# EAGLE design testBench (EAGLE 9.6.2)
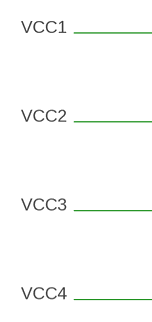
[diagram p0: schematic, sheet 1, part 1 of 2]
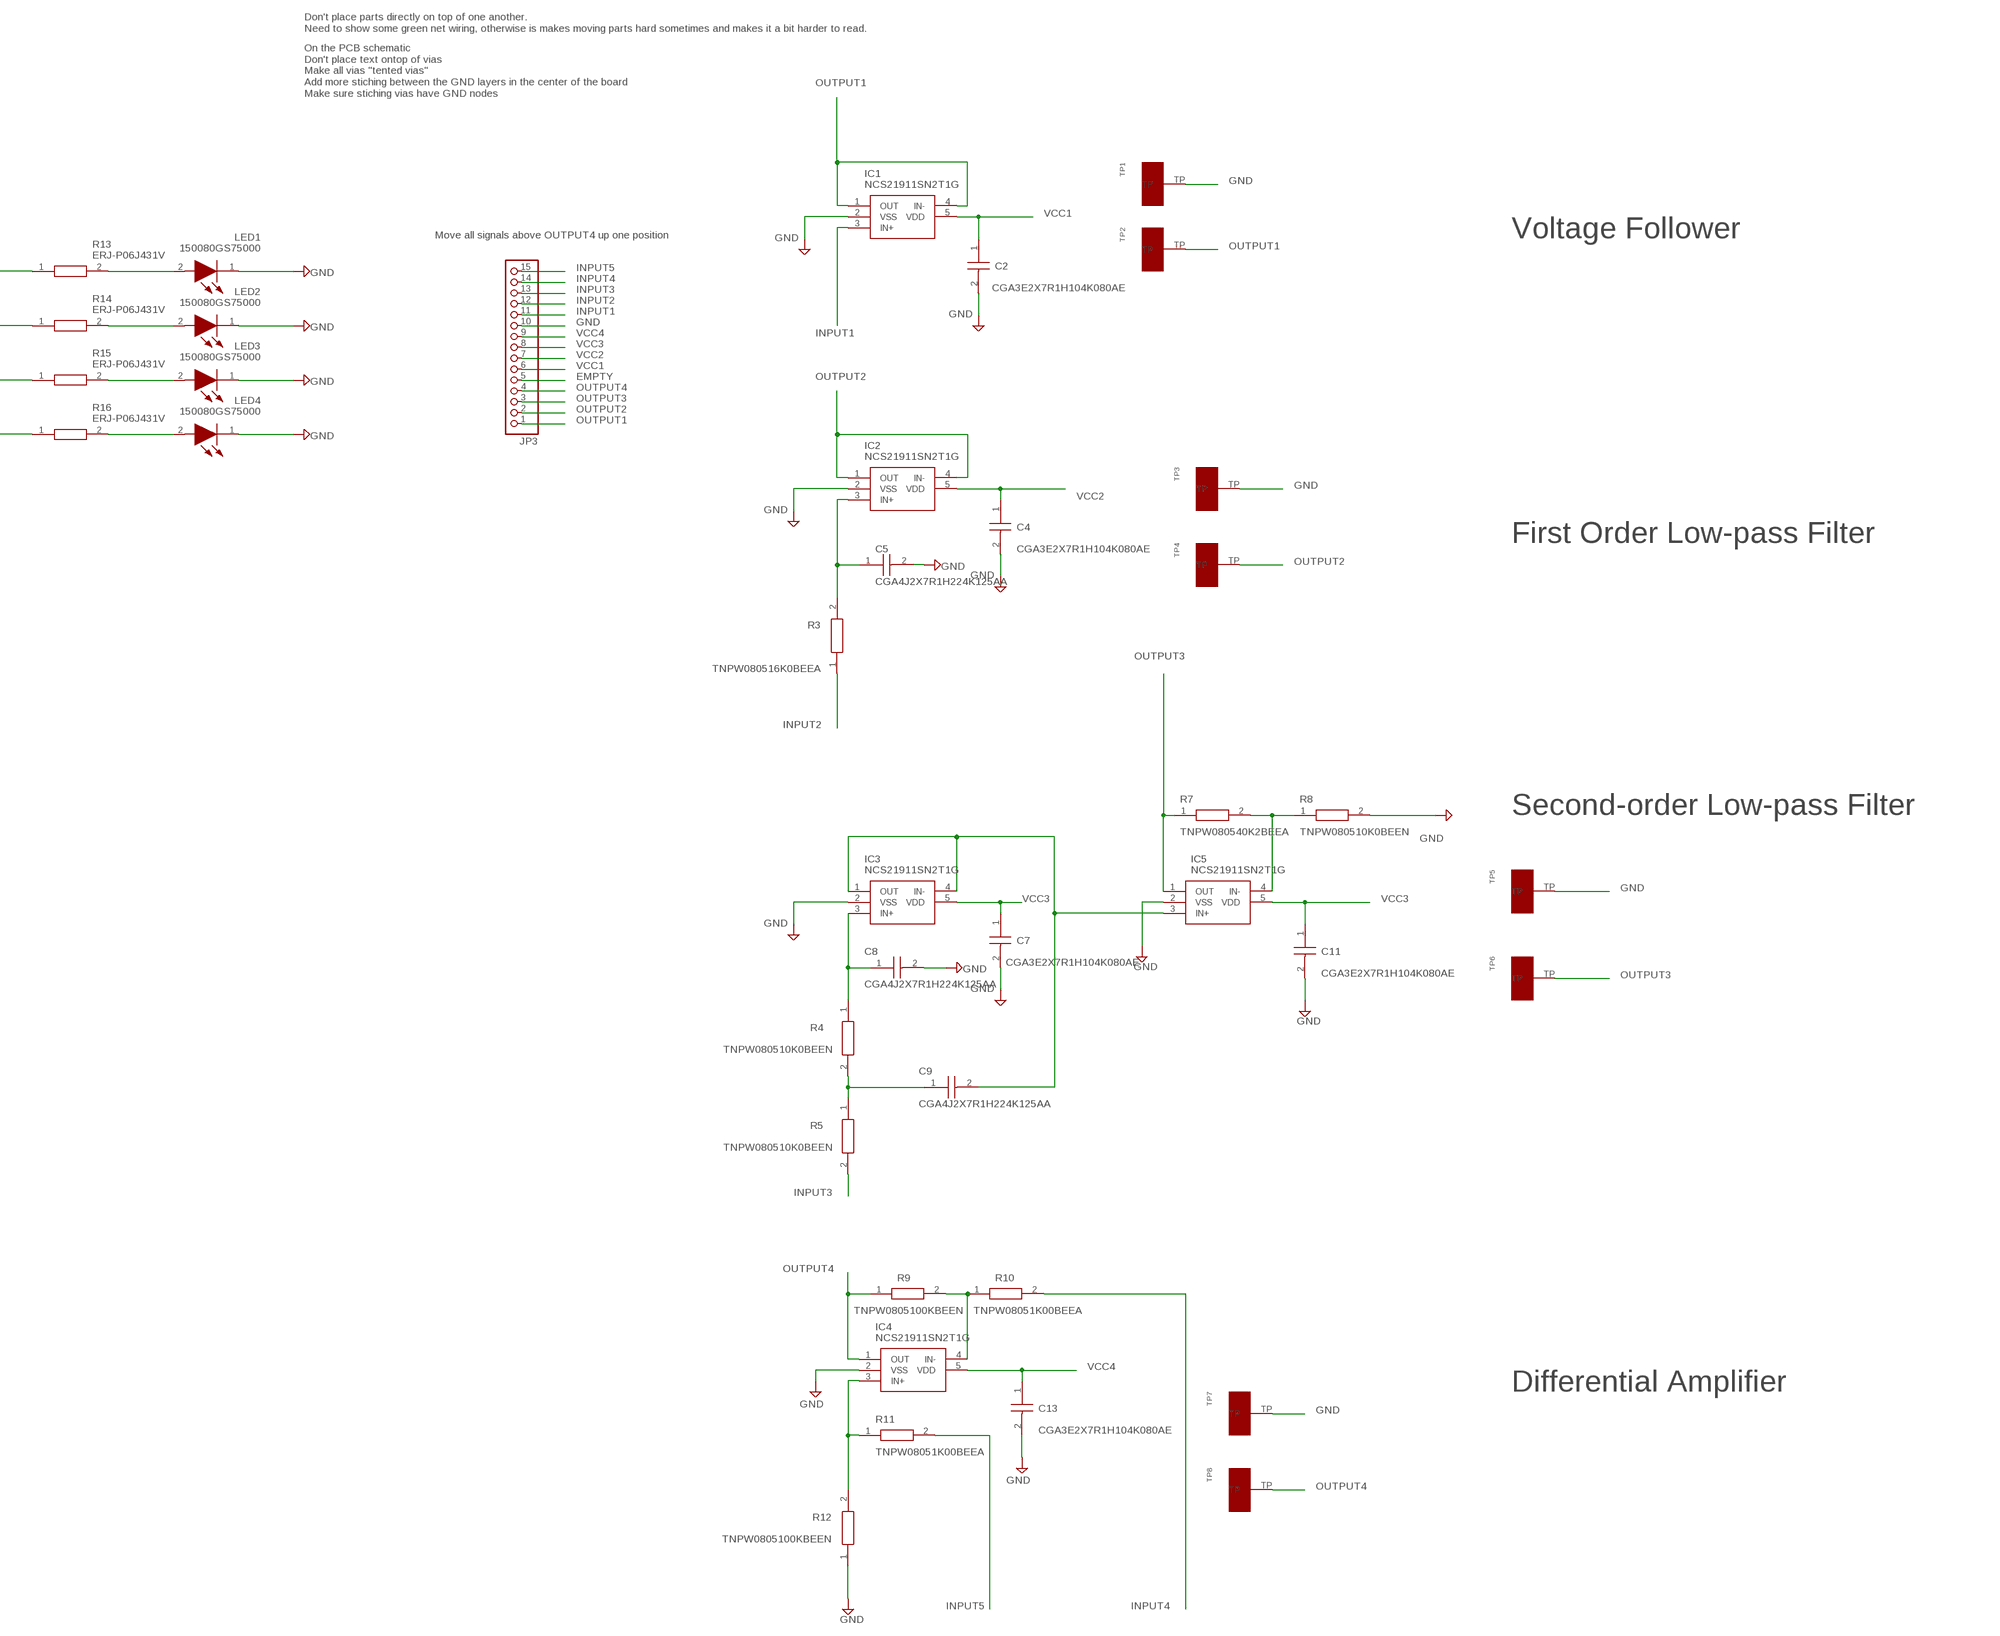
[diagram p1: schematic, sheet 1, part 2 of 2]

## Parts
C2  CGA3E2X7R1H104K080AE  [CAPC1608X90N]
C4  CGA3E2X7R1H104K080AE  [CAPC1608X90N]
C5  CGA4J2X7R1H224K125AA  [CAPC2012X145N]
C7  CGA3E2X7R1H104K080AE  [CAPC1608X90N]
C8  CGA4J2X7R1H224K125AA  [CAPC2012X145N]
C9  CGA4J2X7R1H224K125AA  [CAPC2012X145N]
C11  CGA3E2X7R1H104K080AE  [CAPC1608X90N]
C13  CGA3E2X7R1H104K080AE  [CAPC1608X90N]
IC1  NCS21911SN2T1G  [SOT95P275X110-5N]
IC2  NCS21911SN2T1G  [SOT95P275X110-5N]
IC3  NCS21911SN2T1G  [SOT95P275X110-5N]
IC4  NCS21911SN2T1G  [SOT95P275X110-5N]
IC5  NCS21911SN2T1G  [SOT95P275X110-5N]
JP3  PINHD-1X15  [1X15]
LED1  150080GS75000  [LEDM2012X80N]
LED2  150080GS75000  [LEDM2012X80N]
LED3  150080GS75000  [LEDM2012X80N]
LED4  150080GS75000  [LEDM2012X80N]
R3  TNPW080516K0BEEA  TNPW080510K0BEEN  [RESC2013X65N]
R4  TNPW080510K0BEEN  [RESC2013X65N]
R5  TNPW080510K0BEEN  [RESC2013X65N]
R7  TNPW080540K2BEEA  [RESC2013X65N]
R8  TNPW080510K0BEEN  [RESC2013X65N]
R9  TNPW0805100KBEEN  [RESC2013X65N]
R10  TNPW08051K00BEEA  [RESC2012X55N]
R11  TNPW08051K00BEEA  [RESC2012X55N]
R12  TNPW0805100KBEEN  [RESC2013X65N]
R13  ERJ-P06J431V  [ERJP06_(0805)]
R14  ERJ-P06J431V  [ERJP06_(0805)]
R15  ERJ-P06J431V  [ERJP06_(0805)]
R16  ERJ-P06J431V  [ERJP06_(0805)]
TP1  S1751-46R  [1.85X3.45_MM]
TP2  S1751-46R  [1.85X3.45_MM]
TP3  S1751-46R  [1.85X3.45_MM]
TP4  S1751-46R  [1.85X3.45_MM]
TP5  S1751-46R  [1.85X3.45_MM]
TP6  S1751-46R  [1.85X3.45_MM]
TP7  S1751-46R  [1.85X3.45_MM]
TP8  S1751-46R  [1.85X3.45_MM]

## Nets
EMPTY: JP3.5
GND: C2.2 C4.2 C5.2 C7.2 C8.2 C11.2 C13.2 IC1.2(VSS) IC2.2(VSS) IC3.2(VSS) IC4.2(VSS) IC5.2(VSS) JP3.10 LED1.1(K) LED2.1(K) LED3.1(K) LED4.1(K) R8.2 R12.1 TP1.TP TP3.TP TP5.TP TP7.TP
INPUT1: IC1.3(IN+) JP3.11
INPUT2: JP3.12 R3.1
INPUT3: JP3.13 R5.2
INPUT4: JP3.14 R10.2
INPUT5: JP3.15 R11.2
N$1: C8.1 IC3.3(IN+) R4.1
N$10: C9.1 R4.2 R5.1
N$11: C9.2 IC3.1(OUT) IC3.4(IN-) IC5.3(IN+)
N$12: IC4.3(IN+) R11.1 R12.2
N$13: C5.1 IC2.3(IN+) R3.2
N$15: IC4.4(IN-) R9.2 R10.1
N$20: IC5.4(IN-) R7.2 R8.1
N$23: LED1.2(A) R13.2
N$30: LED2.2(A) R14.2
N$31: LED3.2(A) R15.2
N$32: LED4.2(A) R16.2
OUTPUT1: IC1.1(OUT) IC1.4(IN-) JP3.1 TP2.TP
OUTPUT2: IC2.1(OUT) IC2.4(IN-) JP3.2 TP4.TP
OUTPUT3: IC5.1(OUT) JP3.3 R7.1 TP6.TP
OUTPUT4: IC4.1(OUT) JP3.4 R9.1 TP8.TP
VCC1: C2.1 IC1.5(VDD) JP3.6 R13.1
VCC2: C4.1 IC2.5(VDD) JP3.7 R14.1
VCC3: C7.1 C11.1 IC3.5(VDD) IC5.5(VDD) JP3.8 R15.1
VCC4: C13.1 IC4.5(VDD) JP3.9 R16.1

## Notes on the sheet
- Don't place parts directly on top of one another.
  Need to show some green net wiring, otherwise is makes moving parts hard sometimes and makes it a bit harder to read.
- On the PCB schematic
  Don't place text ontop of vias
  Make all vias "tented vias"
  Add more stiching between the GND layers in the center of the board
  Make sure stiching vias have GND nodes
- Move all signals above OUTPUT4 up one position | Voltage Follower
- First Order Low-pass Filter
- Second-order Low-pass Filter
- Differential Amplifier

## Library data of the parts
C2 C4 C7 C11 C13 = SamacSys_Parts:CGA3E2X7R1H104K080AE: Source: Datasheet; HEIGHT: 0.9mm; MANUFACTURER_NAME: TDK; MANUFACTURER_PART_NUMBER: CGA3E2X7R1H104K080AE; MOUSER_PART_NUMBER: 810-CGA3E2X7R1H104KE; MOUSER_PRICE-STOCK: https://www.mouser.co.uk/ProductDetail/TDK/CGA3E2X7R1H104K080AE?qs=n%2FVzw7c4a0kvajqFvEbDzQ%3D%3D
C5 C8 C9 = SamacSys_Parts:CGA4J2X7R1H224K125AA: Capacitor Auto CGA 0805 50V 220nF X7R Source: Datasheet; DESCRIPTION: Capacitor Auto CGA 0805 50V 220nF X7R; HEIGHT: 1.45mm; MANUFACTURER_NAME: TDK; MANUFACTURER_PART_NUMBER: CGA4J2X7R1H224K125AA; MOUSER_PART_NUMBER: 810-CGA4J2X7R1H224K; MOUSER_PRICE-STOCK: https://www.mouser.co.uk/ProductDetail/TDK/CGA4J2X7R1H224K125AA?qs=NRhsANhppD9di1dONpUYtQ%3D%3D
IC1-IC5 = SamacSys_Parts:NCS21911SN2T1G: Operational Amplifiers - Op Amps 2 MHz Source: Datasheet <https://www.arrow.com/en/products/ncs21911sn2t1g/on-semiconductor>; DESCRIPTION: Operational Amplifiers - Op Amps 2 MHz; HEIGHT: 1.1mm; MANUFACTURER_NAME: ON Semiconductor; MANUFACTURER_PART_NUMBER: NCS21911SN2T1G; MOUSER_PART_NUMBER: 863-NCS21911SN2T1G; MOUSER_PRICE-STOCK: https://www.mouser.co.uk/ProductDetail/ON-Semiconductor/NCS21911SN2T1G/?qs=%252B6g0mu59x7Ix%2FTFBhvJ5Cw%3D%3D
JP3 = pinhead:PINHD-1X15: PIN HEADER
LED1-LED4 = SamacSys_Parts:150080GS75000: 150080GS75000, Wurth Elektronik WL-SMCW 520 nm Green LED, 2012 (0805) Clear SMD package Source: Datasheet <https://katalog.we-online.com/led/datasheet/150080GS75000.pdf>; DESCRIPTION: 150080GS75000, Wurth Elektronik WL-SMCW 520 nm Green LED, 2012 (0805) Clear SMD package; HEIGHT: 0.8mm; MANUFACTURER_NAME: Wurth Elektronik; MANUFACTURER_PART_NUMBER: 150080GS75000; MOUSER_PART_NUMBER: 710-150080GS75000; MOUSER_PRICE-STOCK: https://www.mouser.co.uk/ProductDetail/Wurth-Elektronik/150080GS75000?qs=2kOmHSv6VfQRoTEZVk1mGA%3D%3D
R3-R5 R8 = SamacSys_Parts:TNPW080510K0BEEN: RESISTOR, 0805 10K Ohms +/-0.1% 0.125 W Source: Datasheet; DESCRIPTION: RESISTOR, 0805 10K Ohms +/-0.1% 0.125 W; HEIGHT: mm; MANUFACTURER_NAME: Vishay; MANUFACTURER_PART_NUMBER: TNPW080510K0BEEN; MOUSER_PART_NUMBER: 71-TNPW080510K0BEEN; MOUSER_PRICE-STOCK: https://www.mouser.co.uk/ProductDetail/Vishay-Dale/TNPW080510K0BEEN?qs=dafR6q3Fy0zykY041qLtTg%3D%3D
R7 = SamacSys_Parts:TNPW080540K2BEEA: Vishay TNPW Series Thin Film Surface Mount Resistor 0805 Case 40.2k +/-0.1% +/-25ppm/K Source: Datasheet; DESCRIPTION: Vishay TNPW Series Thin Film Surface Mount Resistor 0805 Case 40.2k +/-0.1% +/-25ppm/K; HEIGHT: mm; MANUFACTURER_NAME: Vishay; MANUFACTURER_PART_NUMBER: TNPW080540K2BEEA; MOUSER_PART_NUMBER: 71-TNPW080540K2BEEA; MOUSER_PRICE-STOCK: https://www.mouser.co.uk/ProductDetail/Vishay-Dale/TNPW080540K2BEEA?qs=VPmSHZfPCebLCJhbDJx4Qw%3D%3D
R9 R12 = SamacSys_Parts:TNPW0805100KBEEN: RESISTOR, 0805 100K Ohms +/-0.1% 0.125 W Source: Datasheet <http://componentsearchengine.com/Datasheets/1/TNPW0805100KBEEN.pdf>; DESCRIPTION: RESISTOR, 0805 100K Ohms +/-0.1% 0.125 W; HEIGHT: mm; MANUFACTURER_NAME: Vishay; MANUFACTURER_PART_NUMBER: TNPW0805100KBEEN; MOUSER_PART_NUMBER: 71-TNPW0805100KBEEN; MOUSER_PRICE-STOCK: https://www.mouser.co.uk/ProductDetail/Vishay-Dale/TNPW0805100KBEEN?qs=CqEPuS5aiX9pmx13XLgzag%3D%3D
R10 R11 = SamacSys_Parts:TNPW08051K00BEEA: Vishay 1k 0805 (2012M) Thin Film SMD Resistor +/-0.1% 0.125W - TNPW08051K00BEEA Source: Datasheet <http://www.vishay.com/docs/28758/tnpw_e3.pdf>; DESCRIPTION: Vishay 1k 0805 (2012M) Thin Film SMD Resistor +/-0.1% 0.125W - TNPW08051K00BEEA; HEIGHT: 0.55mm; MANUFACTURER_NAME: Vishay; MANUFACTURER_PART_NUMBER: TNPW08051K00BEEA; MOUSER_PART_NUMBER: 71-TNPW08051K00BEEA; MOUSER_PRICE-STOCK: https://www.mouser.co.uk/ProductDetail/Vishay-Dale/TNPW08051K00BEEA?qs=O7AkGGjdilV%2FmN4PPIy1cQ%3D%3D
R13-R16 = SamacSys_Parts:ERJ-P06J431V: Thick Film Resistors - SMD 0805 430ohms 0.5W 5% AEC-Q200 Source: Datasheet <https://componentsearchengine.com/Datasheets/1/ERJ-P06J431V.pdf>; DESCRIPTION: Thick Film Resistors - SMD 0805 430ohms 0.5W 5% AEC-Q200; HEIGHT: 0.7mm; MANUFACTURER_NAME: Panasonic; MANUFACTURER_PART_NUMBER: ERJ-P06J431V; MOUSER_PART_NUMBER: 667-ERJ-P06J431V; MOUSER_PRICE-STOCK: https://www.mouser.com/Search/Refine.aspx?Keyword=667-ERJ-P06J431V
TP1-TP8 = SamacSys_Parts:S1751-46R: Circuit Board Hardware - PCB SMT TEST TERMINAL TIN, 2500 PC REEL Source: Datasheet <https://www.mouser.com/datasheet/2/181/S1751R-1220585.pdf>; DESCRIPTION: Circuit Board Hardware - PCB SMT TEST TERMINAL TIN, 2500 PC REEL; HEIGHT: 2mm; MANUFACTURER_NAME: Harwin; MANUFACTURER_PART_NUMBER: S1751-46R; MOUSER_PART_NUMBER: 855-S1751-46R; MOUSER_PRICE-STOCK: https://www.mouser.com/ProductDetail/Harwin/S1751-46R?qs=l6ZPVqNVZb71wETAKrfRig%3D%3D

## Board
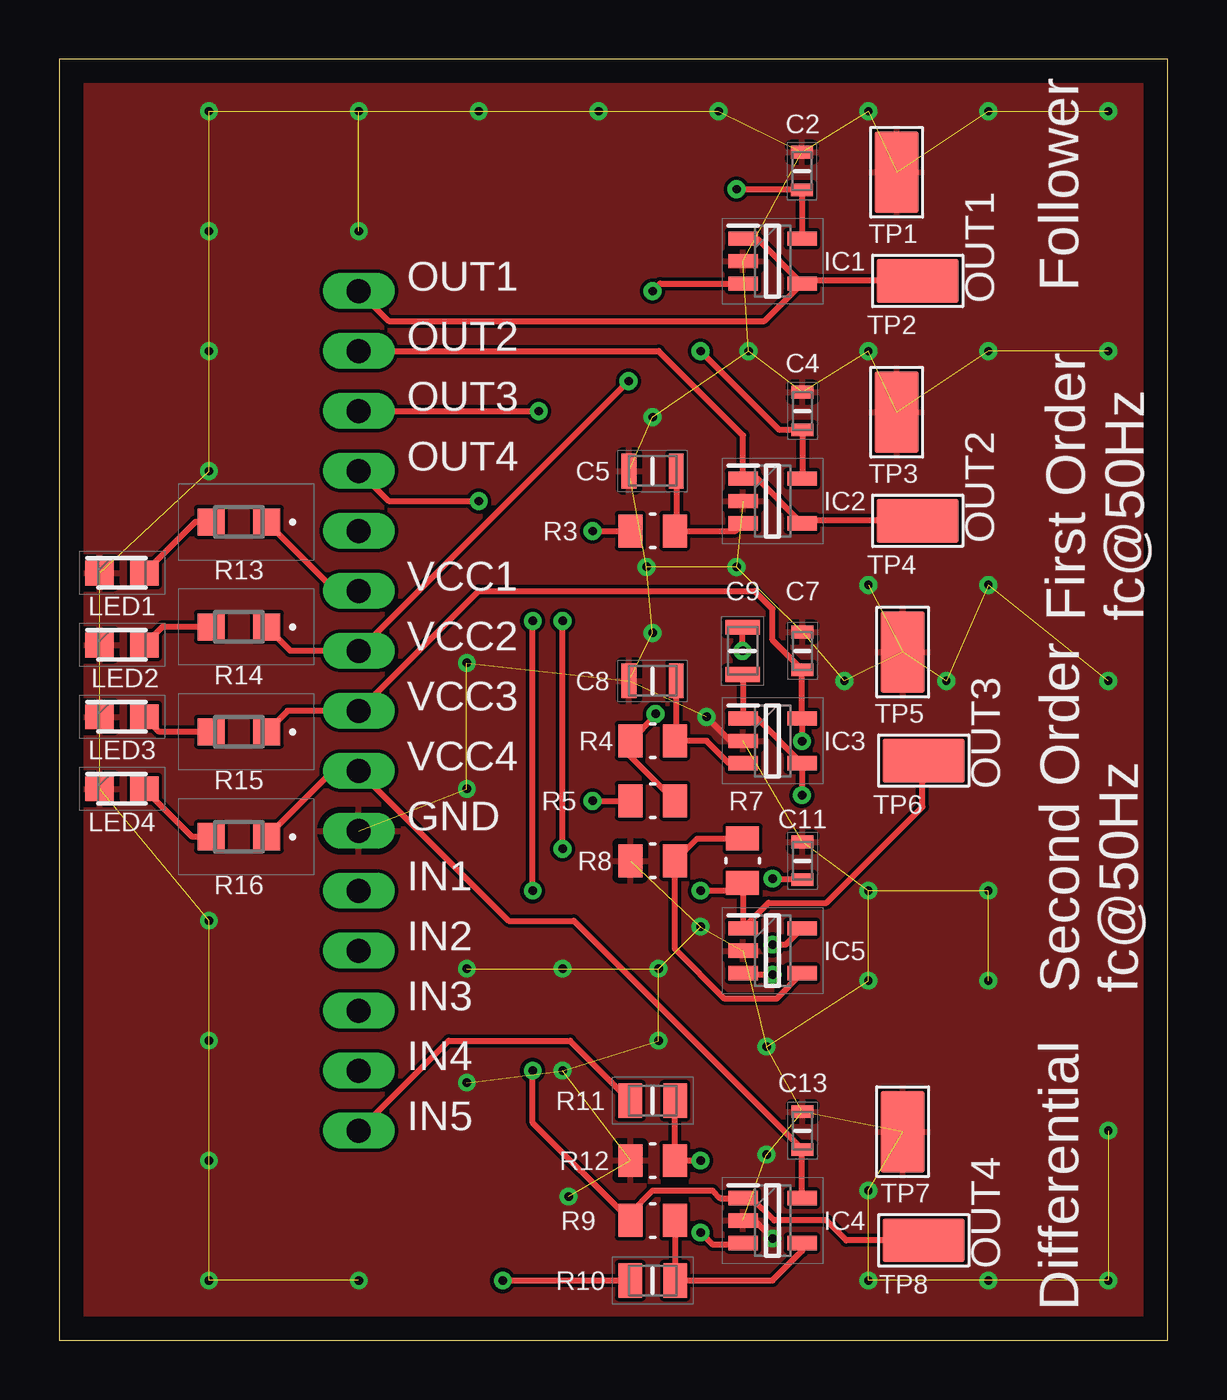
[diagram p2: board, top side]
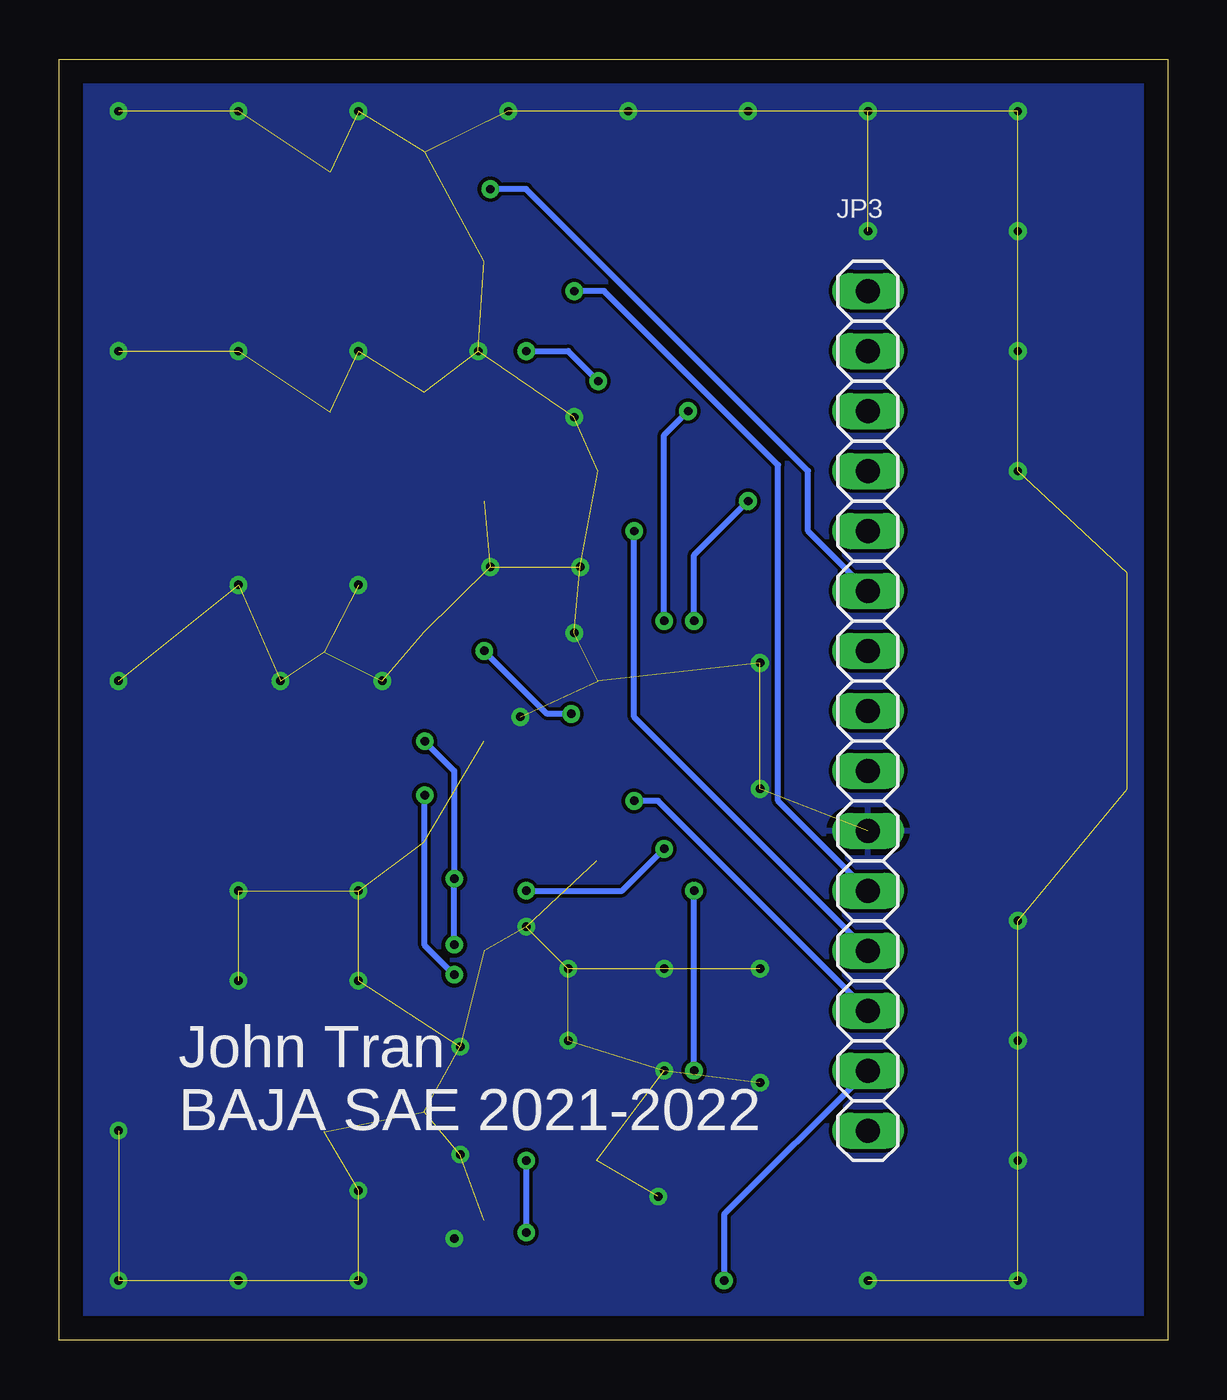
[diagram p3: board, bottom side, seen from below]

Size 46.97 x 54.28 mm. Coordinates in mm from the lower left corner, seen from the top.
Outline: 0,0 46.97,0 46.97,54.28 0,54.28 0,0
Copper layers (1*16): Top 0.035mm / dielectric 1.5mm / Bottom 0.035mm
Design rules "default *": minimum track width 6mil, minimum drill 0.35mm, track to track 6mil, track to pad 6mil, pad to pad 6mil, via to via 6mil, smd to smd 6mil, copper to edge 40mil, drill to drill 6mil, minimum pad ring 10mil, minimum via ring 8mil, stop-mask expansion 4mil, vias tented up to drill 14mil, thermal gap 10mil

### Footprints (pad centres in the part's own frame; a part is rotated, then mirrored left to right if it is on the bottom)
CAPC1608X90N = smd 0.54 x 0.94: 1 -0.8,0; 2 0.8,0
CAPC2012X145N = smd 0.62 x 1.47: 1 -1,0; 2 1,0
SOT95P275X110-5N = smd 1.25 x 0.6: 1 -1.25,0.95; 2 -1.25,0; 3 -1.25,-0.95; 4 1.25,-0.95; 5 1.25,0.95
1X15 = drill 1.016 long: 1 -17.78,0; 2 -15.24,0; 3 -12.7,0; 4 -10.16,0; 5 -7.62,0; 6 -5.08,0; 7 -2.54,0; 8 0,0; 9 2.54,0; 10 5.08,0; 11 7.62,0; 12 10.16,0; 13 12.7,0; 14 15.24,0; 15 17.78,0
LEDM2012X80N = smd 1.2 x 1.05: 1 -0.95,0; 2 0.95,0
RESC2013X65N = smd 1.016 x 1.397: 1 -0.94,0; 2 0.94,0
RESC2012X55N = smd 1 x 1.45: 1 -0.95,0; 2 0.95,0
ERJP06_(0805) = smd 1.15 x 1.15: 1 -1.175,0; 2 1.175,0
1.85X3.45_MM = smd 1.85 x 3.45: TP 0.94,1.727

### Placement (x,y rotation side)
C2  31.47,49.53 90 top
C4  31.5,39.37 90 top
C5  25.15,36.83 180 top
C7  31.5,29.21 90 top
C8  25.15,27.94 180 top
C9  28.96,29.21 270 top
C11  31.5,20.32 90 top
C13  31.5,8.89 90 top
IC1  30.23,45.72 0 top
IC2  30.23,35.56 0 top
IC3  30.23,25.4 0 top
IC4  30.23,5.08 0 top
IC5  30.23,16.51 0 top
JP3  12.7,26.67 270 bottom
LED1  2.67,32.51 0 top
LED2  2.67,29.46 0 top
LED3  2.67,26.42 0 top
LED4  2.67,23.37 0 top
R3  25.15,34.29 0 top
R4  25.15,25.4 180 top
R5  25.15,22.86 180 top
R7  28.96,20.32 90 top
R8  25.15,20.32 180 top
R9  25.15,5.08 0 top
R10  25.15,2.54 180 top
R11  25.15,10.16 180 top
R12  25.15,7.62 0 top
R13  7.62,34.67 180 top
R14  7.62,30.23 180 top
R15  7.62,25.78 180 top
R16  7.62,21.34 180 top
TP1  34.54,47.75 0 top
TP2  38.1,43.94 90 top
TP3  34.54,37.59 0 top
TP4  38.1,33.78 90 top
TP5  34.8,27.43 0 top
TP6  38.35,23.62 90 top
TP7  34.8,7.11 0 top
TP8  38.35,3.3 90 top

### Tracks (layer width: path | path; a pad name or v marks a point on that pad's centre or on a via)
GND  (via drill 0.35)  (73 unrouted)
  Top 0.152: 28.68,45.72 IC1.2
  Top 0.254: 28.61,5.08 IC4.2 29.46,5.08 v30.23,4.32 | 28.61,25.4 IC3.2 28.45,25.4 v27.43,26.42 | 28.61,35.56 IC2.2 | 28.61,45.72 28.68,45.72
  other vias: 12.7,52.07 44.45,52.07 44.45,2.54 12.7,2.54 17.78,52.07 22.86,52.07 12.7,46.99 44.45,8.89 44.45,27.94 44.45,41.91 34.29,41.91 28.7,32.77 39.37,52.07 34.29,52.07 27.94,52.07 39.37,2.54 34.29,2.54 39.37,15.24 34.29,15.24 39.37,41.91 29.21,41.91 37.59,27.94 33.27,27.94 34.29,32 25.15,29.97 24.89,32.77 21.34,15.75 21.59,6.1 21.34,11.43 25.4,15.75 39.37,32 39.37,19.05 34.29,19.05 17.27,15.75 17.27,10.92 17.27,28.7 17.27,23.37 25.15,39.12 29.97,12.45 25.4,12.7 29.97,7.87 34.29,6.35 27.18,17.53 6.35,2.54 6.35,7.62 6.35,12.7 6.35,17.78 6.35,52.07 6.35,46.99 6.35,41.91 6.35,36.83
  pour Top: 46.97,0 0,0 0,54.28 46.97,54.28
  pour Bottom: 0,54.61 46.99,54.61 46.99,0 0,0
INPUT1  (via drill 0.35)
  Top 0.254: v25.15,44.45 25.47,44.77 IC1.3
  Bottom 0.254: v25.15,44.45 23.88,44.45 16.51,37.08 16.51,22.86 JP3.11
INPUT2  (via drill 0.35)
  Top 0.254: v22.61,34.29 R3.1
  Bottom 0.254: v22.61,34.29 22.61,26.42 JP3.12
INPUT3  (via drill 0.35)
  Top 0.254: v22.61,22.86 R5.2
  Bottom 0.254: v22.61,22.86 21.59,22.86 JP3.13
INPUT4  (via drill 0.35)
  Top 0.254: v18.8,2.54 R10.2
  Bottom 0.254: v18.8,2.54 18.8,5.33 JP3.14
INPUT5
  Top 0.254: R11.2 21.66,12.7 16.51,12.7 JP3.15
N$1
  Top 0.254: C8.1 26.15,25.46 R4.1 27.43,25.4 28.38,24.45 IC3.3
N$10  (via drill 0.35)
  Top 0.254: R5.1 24.21,24.74 R4.2 | 23.88,25.4 R4.2 | R4.2 25.27,26.47 v25.27,26.54 | v28.96,29.21 C9.1
  Bottom 0.254: v25.27,26.54 26.29,26.54 v28.96,29.21
N$11  (via drill 0.35)
  Top 0.254: C9.2 28.98,28.19 IC3.1 29.58,26.35 IC3.4 v31.48,23.09 | 29.35,15.56 IC5.3 29.04,15.49 v30.23,15.49
  Bottom 0.254: 31.5,23.07 v31.48,23.09 31.48,16.74 v30.23,15.49
N$12  (via drill 0.35)
  Top 0.254: R11.1 R12.2 v27.18,7.62 | 28.61,4.13 IC4.3 28.91,4.06 27.69,4.06 v27.18,4.57
  Bottom 0.254: v27.18,7.62 v27.18,4.57
N$13
  Top 0.254: C5.1 26.15,34.35 R3.2 28.66,34.29 IC2.3
N$15
  Top 0.254: R9.2 R10.1 30.23,2.54 31.48,3.79 IC4.4
N$20
  Top 0.254: 31.18,15.56 IC5.4 30.39,14.48 28.19,14.48 26.09,16.59 R8.1 27.03,21.26 R7.2
N$23
  Top 0.254: R13.2 5.78,34.67 LED1.2
N$30
  Top 0.254: R14.2 4.38,30.23 LED2.2
N$31
  Top 0.254: R15.2 4.25,25.78 LED3.2
N$32
  Top 0.254: 3.87,23.24 3.74,23.37 LED4.2 5.65,21.34 R16.2
OUTPUT1
  Top 0.152: IC1.4 31.5,44.75
  Top 0.254: IC1.1 29.58,46.67 IC1.4 | IC1.4 29.89,43.18 13.97,43.18 JP3.1 | TP2.TP 31.59,44.88 IC1.4
OUTPUT2
  Top 0.254: TP4.TP 31.59,34.72 IC2.4 29.58,36.51 IC2.1 28.98,38.33 25.4,41.91 JP3.2
OUTPUT3  (via drill 0.35)
  Top 0.254: 36.26,24.56 36.58,24.56 | 36.58,24.56 TP6.TP | JP3.3 v20.32,39.37 | 36.58,24.56 36.58,22.61 32.51,18.54 30.06,18.54 IC5.1 28.98,19.36 R7.1 28.63,19.05 v27.18,19.05 | v21.34,20.83 v21.34,30.48
  Bottom 0.254: v21.34,30.48 21.34,38.35 v20.32,39.37 | v27.18,19.05 23.11,19.05 v21.34,20.83
OUTPUT4  (via drill 0.35)
  Top 0.152: 29.28,6.03 IC4.1
  Top 0.254: IC4.1 28.01,6.03 27.69,6.35 25.15,6.35 24.21,5.41 R9.1 20.07,9.22 v20.07,11.43 | v20.07,19.05 v20.07,30.48 | v17.78,35.56 13.97,35.56 JP3.4 | TP8.TP 33.35,4.24 32.51,5.08 30.3,5.08 29.35,6.03 29.28,6.03
  Bottom 0.254: v20.07,11.43 v20.07,19.05 | v20.07,30.48 20.07,33.27 v17.78,35.56
VCC1  (via drill 0.35)
  Top 0.254: C2.1 31.48,48.51 | 31.48,48.51 IC1.5 | v28.7,48.77 31.22,48.77 31.48,48.51 | JP3.6 11.72,31.75 R13.1
  Bottom 0.254: v28.7,48.77 27.18,48.77 15.24,36.83 15.24,34.29 JP3.6
VCC2  (via drill 0.35)
  Top 0.254: IC2.5 31.5,36.53 C4.1 30.52,38.57 v27.18,41.91 | v24.13,40.64 JP3.7 9.81,29.21 R14.1 9.18,29.84
  Bottom 0.254: v24.13,40.64 25.4,41.91 v27.18,41.91
VCC3  (via drill 0.35)
  Top 0.254: v31.48,25.38 IC3.5 31.48,28.39 C7.1 30.23,29.68 30.23,30.99 29.46,31.75 17.78,31.75 JP3.8 9.68,26.67 R15.1 | v31.48,25.38 | v30.23,19.56 31.46,19.56 C11.1 | IC5.5 30.78,16.76 v30.23,16.76
  Bottom 0.254: v31.48,25.38 30.23,24.13 v30.23,19.56 v30.23,16.76
VCC4
  Top 0.254: IC4.5 31.48,8.07 C13.1 21.81,17.78 19.05,17.78 JP3.9 11.59,24.13 R16.1

### Text on the board
tPlace: Follower | First Order / fc@50Hz | Second Order / fc@50Hz | Differential
bPlace: John Tran / BAJA SAE 2021-2022
tNames: OUT1 | OUT1 | OUT2 | OUT3 | OUT4 | OUT2 | VCC1 | VCC2 | VCC3 | VCC4 | OUT3 | GND | IN1 | IN2 | IN3 | IN4 | IN5 | OUT4